# EAGLE design switch-matrix (EAGLE 7.2.0)
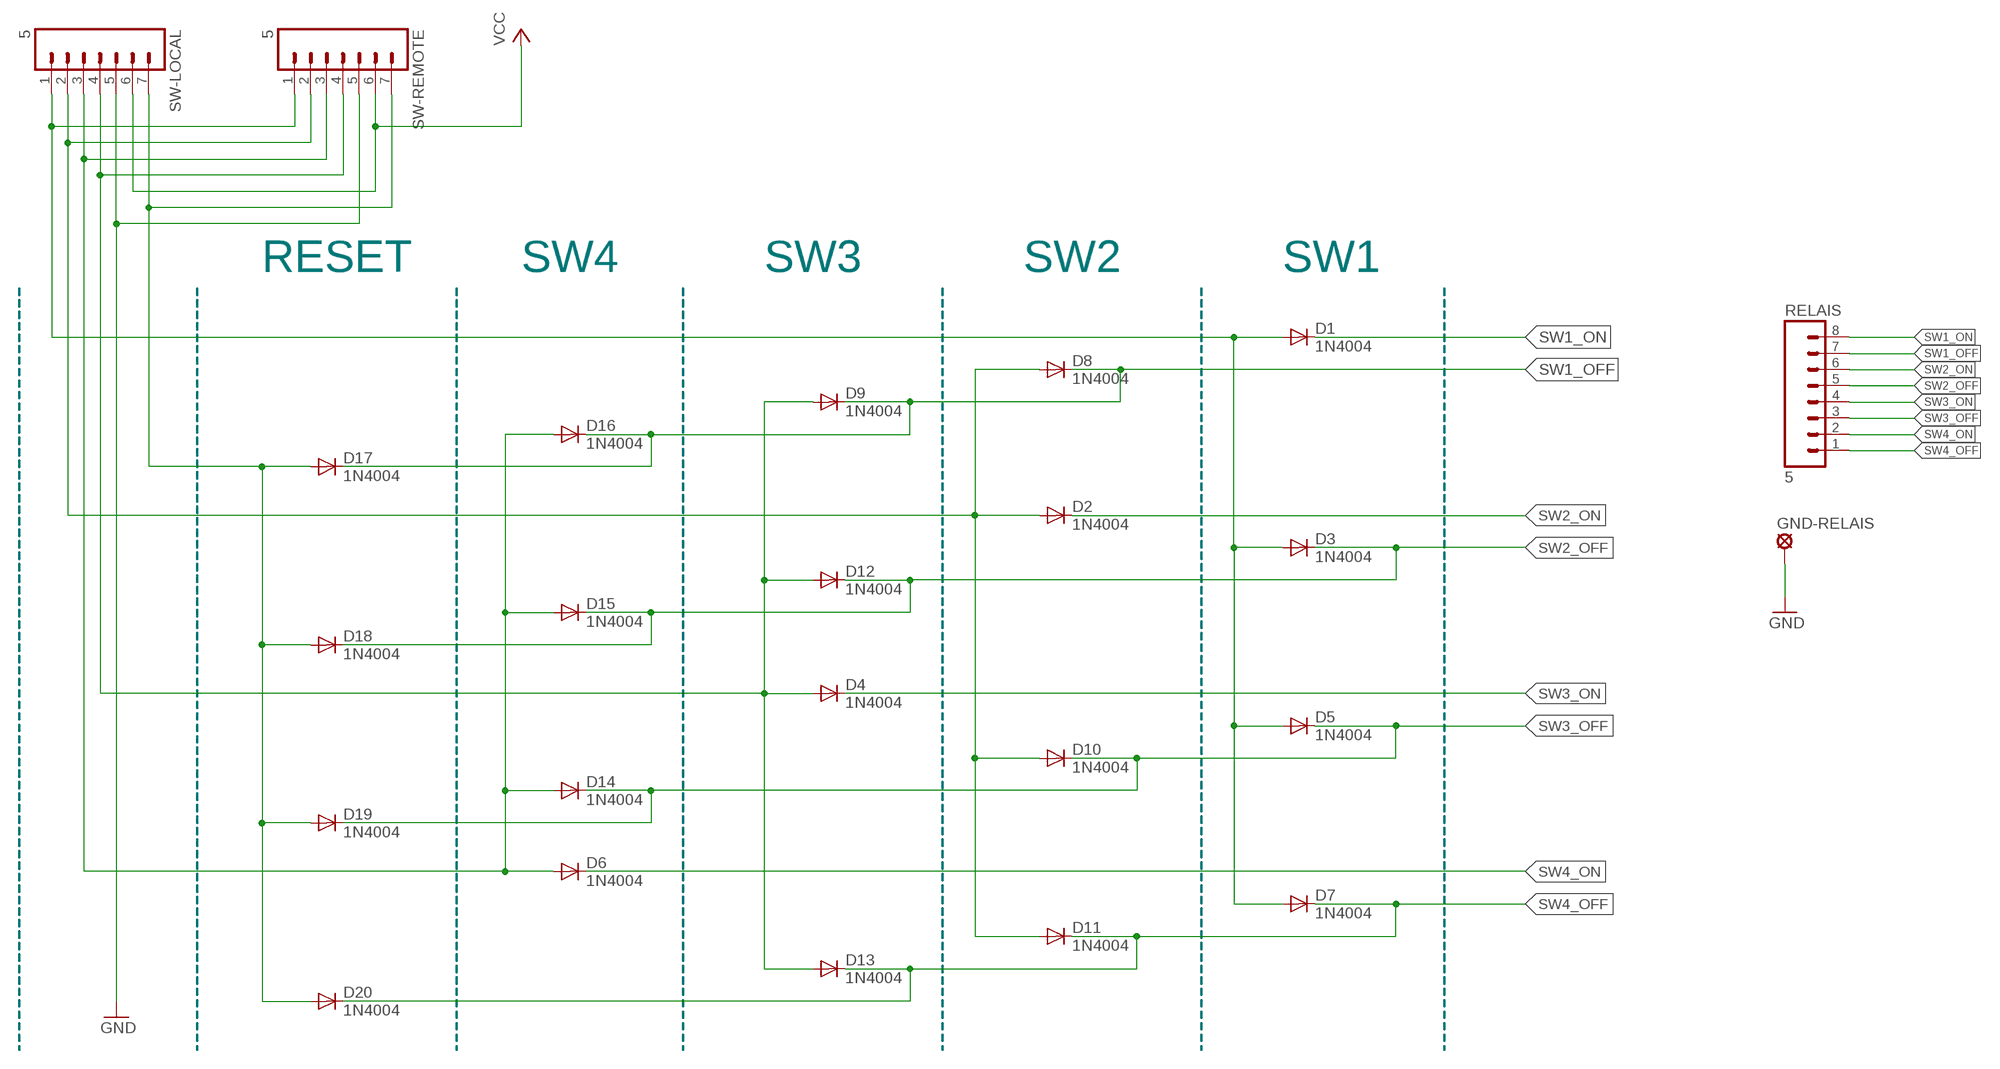
[diagram p0: schematic, sheet 1]

## Parts
D1  1N4004  [DO41-10]
D2  1N4004  [DO41-10]
D3  1N4004  [DO41-10]
D4  1N4004  [DO41-10]
D5  1N4004  [DO41-10]
D6  1N4004  [DO41-10]
D7  1N4004  [DO41-10]
D8  1N4004  [DO41-10]
D9  1N4004  [DO41-10]
D10  1N4004  [DO41-10]
D11  1N4004  [DO41-10]
D12  1N4004  [DO41-10]
D13  1N4004  [DO41-10]
D14  1N4004  [DO41-10]
D15  1N4004  [DO41-10]
D16  1N4004  [DO41-10]
D17  1N4004  [DO41-10]
D18  1N4004  [DO41-10]
D19  1N4004  [DO41-10]
D20  1N4004  [DO41-10]
GND-RELAIS  LSP10  [LSP10]
RELAIS  5  MA08  [08PA]
SW-LOCAL  5  MA07  [07PA]
SW-REMOTE  5  MA07  [07PA]

## Nets
GND: GND-RELAIS.MP SW-LOCAL.5 SW-REMOTE.5
N$1: D1.A D3.A D5.A D7.A SW-LOCAL.1 SW-REMOTE.1
N$3: D17.A D18.A D19.A D20.A SW-LOCAL.7 SW-REMOTE.7
N$5: D4.A D9.A D12.A D13.A SW-LOCAL.4 SW-REMOTE.4
N$12: D6.A D14.A D15.A D16.A SW-LOCAL.3 SW-REMOTE.3
N$14: D2.A D8.A D10.A D11.A SW-LOCAL.2 SW-REMOTE.2
SW1_OFF: D8.C D9.C D16.C D17.C RELAIS.7
SW1_ON: D1.C RELAIS.8
SW2_OFF: D3.C D12.C D15.C D18.C RELAIS.5
SW2_ON: D2.C RELAIS.6
SW3_OFF: D5.C D10.C D14.C D19.C RELAIS.3
SW3_ON: D4.C RELAIS.4
SW4_OFF: D7.C D11.C D13.C D20.C RELAIS.1
SW4_ON: D6.C RELAIS.2
VCC: SW-LOCAL.6 SW-REMOTE.6

## Notes on the sheet
- RESET | SW4 | SW3 | SW2 | SW1

## Library data of the parts
D1-D20 = diode:1N4004: DIODE general purpose rectifier, 1 A
GND-RELAIS = solpad:LSP10: SOLDER PAD drill 1.0 mm, distributor Buerklin, 12H555
RELAIS = con-amp-quick:MA08: AMP QUICK CONNECTOR; OC_FARNELL: unknown; OC_NEWARK: unknown
SW-LOCAL SW-REMOTE = con-amp-quick:MA07: AMP QUICK CONNECTOR; OC_FARNELL: unknown; OC_NEWARK: unknown

## Board
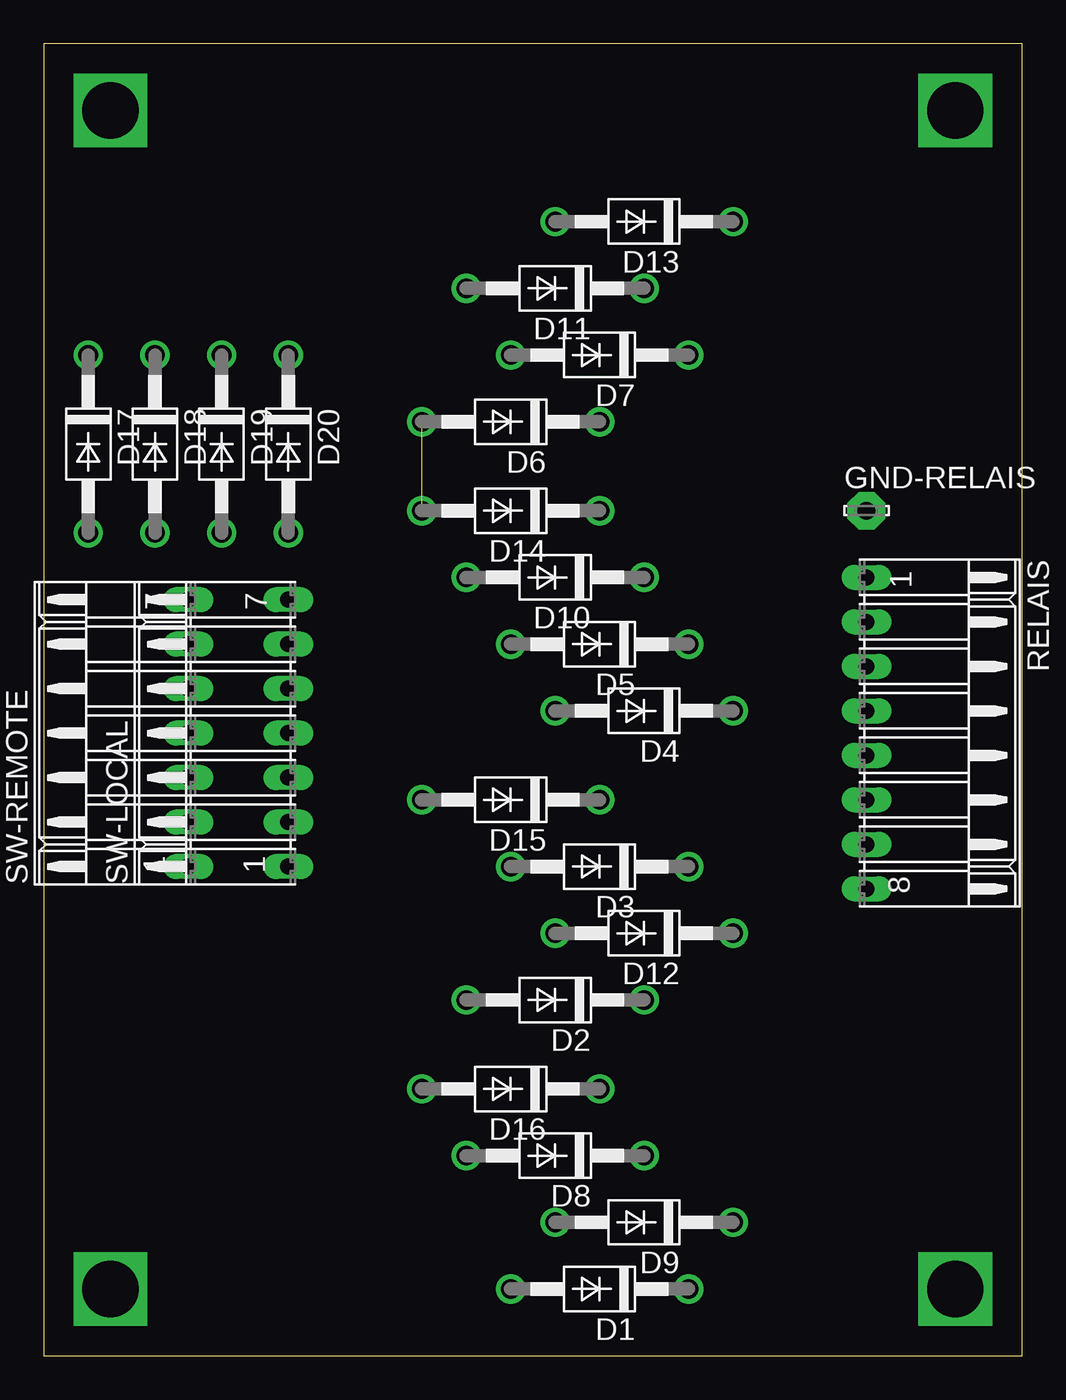
[diagram p1: board, top side]
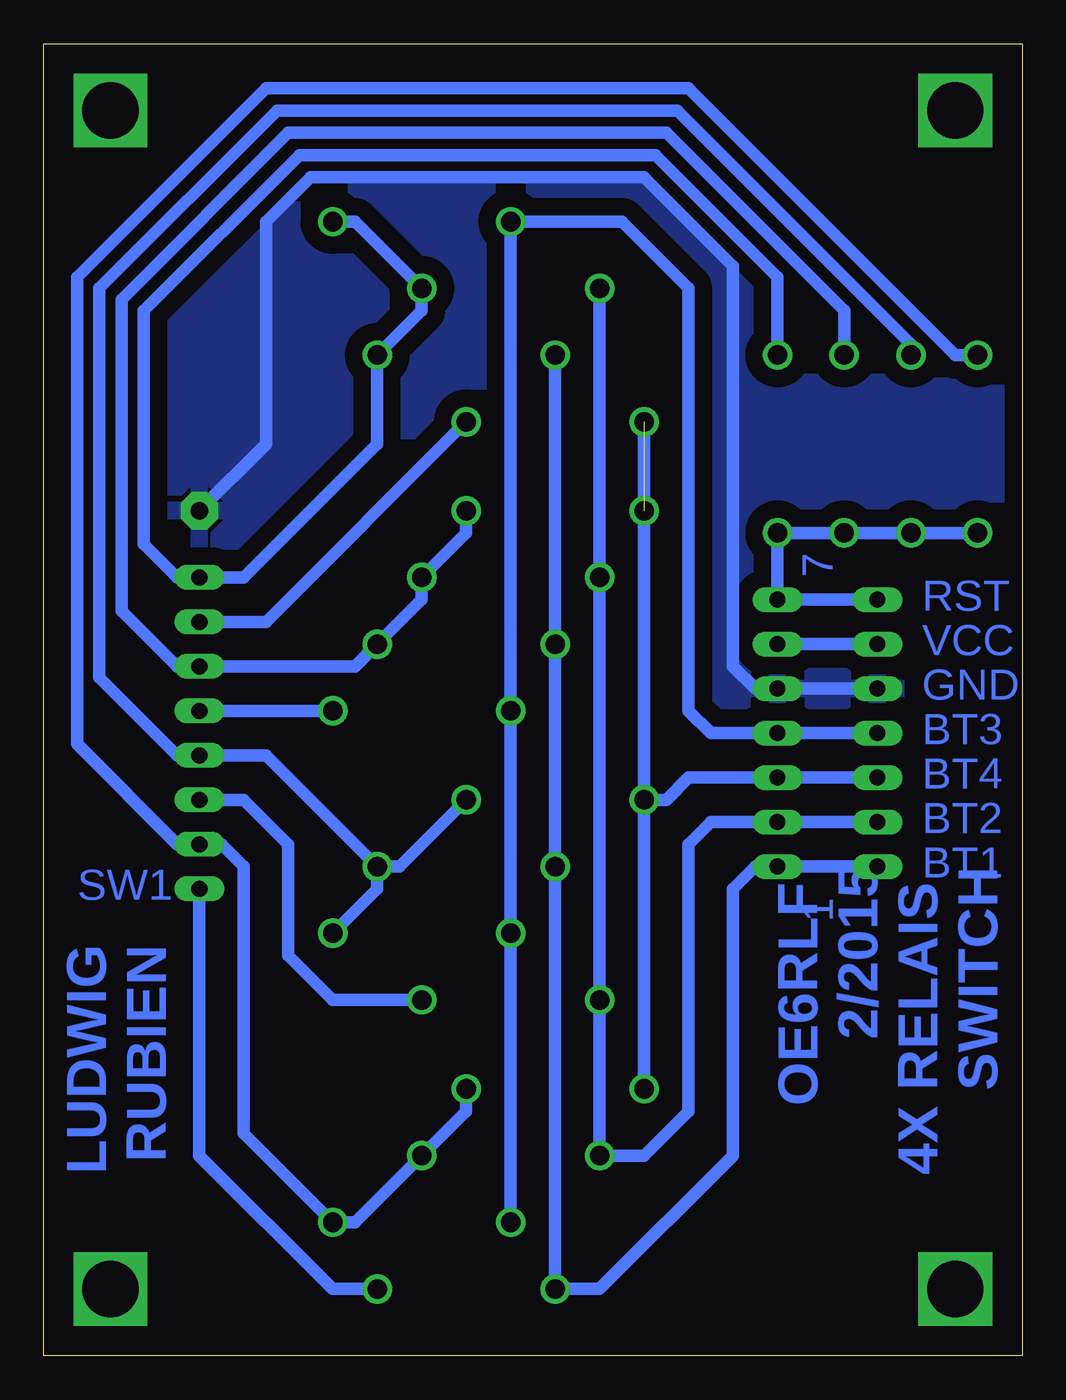
[diagram p2: board, bottom side, seen from below]

Size 55.88 x 74.93 mm. Coordinates in mm from the lower left corner, seen from the top.
Outline: 0,0 55.88,0 55.88,74.93 0,74.92 0,0
Copper layers (1*16): Top 0.035mm / dielectric 1.5mm / Bottom 0.035mm
Design rules "default *": minimum track width 10mil, minimum drill 24mil, track to track 19mil, track to pad 19mil, pad to pad 19mil, via to via 19mil, smd to smd 19mil, copper to edge 40mil, drill to drill 8mil, minimum pad ring 10mil, minimum via ring 8mil, stop-mask expansion 4mil, vias tented up to drill 0mil, thermal gap 10mil

### Footprints (pad centres in the part's own frame; a part is rotated, then mirrored left to right if it is on the bottom)
DO41-10 = drill 1.118: A 5.08,0; C -5.08,0
LSP10 = drill 1.016 pad 2.159 octagon: MP 0,0
08PA = drill 0.914 long: 1 -8.89,0; 2 -6.35,0; 3 -3.81,0; 4 -1.27,0; 5 1.27,0; 6 3.81,0; 7 6.35,0; 8 8.89,0
07PA = drill 0.914 long: 1 -7.62,0; 2 -5.08,0; 3 -2.54,0; 4 0,0; 5 2.54,0; 6 5.08,0; 7 7.62,0

### Placement (x,y rotation side)
D1  31.75,3.81 180 top
D2  29.21,20.32 180 top
D3  31.75,27.94 180 top
D4  34.29,36.83 180 top
D5  31.75,40.64 180 top
D6  26.67,53.34 180 top
D7  31.75,57.15 180 top
D8  29.21,11.43 180 top
D9  34.29,7.62 180 top
D10  29.21,44.45 180 top
D11  29.21,60.96 180 top
D12  34.29,24.13 180 top
D13  34.29,64.77 180 top
D14  26.67,48.26 180 top
D15  26.67,31.75 180 top
D16  26.67,15.24 180 top
D17  2.54,52.07 270 top
D18  6.35,52.07 270 top
D19  10.16,52.07 270 top
D20  13.97,52.07 270 top
GND-RELAIS  46.99,48.26 0 top
RELAIS  46.99,35.56 270 top
SW-LOCAL  13.97,35.56 90 top
SW-REMOTE  8.26,35.56 90 top

### Tracks (layer width: path | path; a pad name or v marks a point on that pad's centre or on a via)
GND
  Bottom 0.7: GND-RELAIS.MP 43.18,52.07 43.18,64.77 40.64,67.31 21.59,67.31 16.51,62.23 16.51,39.37 15.24,38.1 SW-LOCAL.5 SW-REMOTE.5
  pour Bottom (isolate 1): -2.54,76.2 -2.54,-1.27 58.42,-1.27 58.42,76.2
N$1
  Bottom 0.7: D7.A D5.A D3.A D1.A 24.13,3.81 16.51,11.43 16.51,26.67 15.24,27.94 SW-LOCAL.1 SW-REMOTE.1
N$2  (via drill 3.2)
  other vias: 3.81,71.12
N$3
  Bottom 0.7: D17.A D18.A D19.A D20.A SW-LOCAL.7 SW-REMOTE.7
N$4  (via drill 3.2)
  other vias: 52.07,71.12
N$5
  Bottom 0.7: D9.A D12.A D4.A D13.A 22.86,64.77 19.05,60.96 19.05,36.83 17.78,35.56 SW-LOCAL.4 SW-REMOTE.4
N$6  (via drill 3.2)
  other vias: 52.07,3.81
N$7  (via drill 3.2)
  other vias: 3.81,3.81
N$12  (1 unrouted)
  Bottom 0.7: D6.A D15.A | D15.A D16.A | D15.A 20.32,31.75 19.05,33.02 SW-LOCAL.3 SW-REMOTE.3
N$14
  Bottom 0.7: D11.A D10.A D2.A D8.A 21.59,11.43 19.05,13.97 19.05,29.21 17.78,30.48 SW-LOCAL.2 SW-REMOTE.2
SW1_OFF
  Bottom 0.7: D16.C 31.75,13.97 D8.C 38.1,7.62 D9.C 44.45,12.7 44.45,27.94 45.72,29.21 RELAIS.7 48.26,29.21 53.98,34.92 53.98,61.59 43.18,72.39 19.05,72.39 3.81,57.15 D17.C
SW1_ON
  Bottom 0.7: D1.C 39.37,3.81 46.99,11.43 RELAIS.8
SW2_OFF
  Bottom 0.7: D3.C 43.18,34.29 RELAIS.5 48.26,34.29 52.7,38.73 52.7,60.96 42.55,71.12 19.68,71.12 6.35,57.78 D18.C | D12.C 36.83,26.67 D3.C | D3.C 35.56,27.94 D15.C
SW2_ON
  Bottom 0.7: D2.C 39.37,20.32 41.91,22.86 41.91,29.21 44.45,31.75 RELAIS.6
SW3_OFF
  Bottom 0.7: D14.C 31.75,46.99 D10.C 34.29,43.18 D5.C 38.1,39.37 RELAIS.3 48.26,39.37 51.44,42.55 51.44,60.33 41.91,69.85 20.32,69.85 10.16,59.69 D19.C
SW3_ON
  Bottom 0.7: D4.C RELAIS.4
SW4_OFF
  Bottom 0.7: D13.C 38.1,64.77 D11.C 34.29,59.69 D7.C 36.83,52.07 44.45,44.45 RELAIS.1 48.26,44.45 50.16,46.35 50.16,59.69 41.27,68.58 20.95,68.58 13.97,61.59 D20.C
SW4_ON
  Bottom 0.7: RELAIS.2 43.18,41.91 D6.C
VCC
  Bottom 0.7: SW-REMOTE.6 SW-LOCAL.6

### Text on the board
Bottom: 7 | RST | VCC | GND | BT3 | BT4 | BT2 | OE6RLF / 2/2015 / 4X RELAIS / SWITCH | BT1 | SW1 | 1 | LUDWIG / RUBIEN